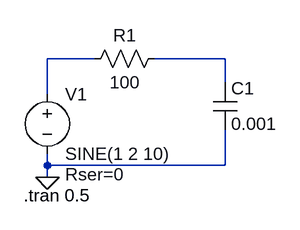
[diagram p0: schematic filtreRC.asc]
filtreRC.asc, the LTspice schematic file:
Version 4
SHEET 1 880 680
WIRE 48 48 -16 48
WIRE 224 48 128 48
WIRE 224 80 224 48
WIRE -16 96 -16 48
WIRE -16 192 -16 176
WIRE 224 192 224 144
WIRE 224 192 -16 192
WIRE -16 208 -16 192
FLAG -16 208 0
SYMBOL voltage -16 80 R0
WINDOW 123 0 0 Left 0
WINDOW 39 24 124 Left 2
SYMATTR SpiceLine Rser=0
SYMATTR InstName V1
SYMATTR Value SINE(1 2 10)
SYMBOL cap 208 80 R0
SYMATTR InstName C1
SYMATTR Value 0.001
SYMBOL res 144 32 R90
WINDOW 0 0 56 VBottom 2
WINDOW 3 32 56 VTop 2
SYMATTR InstName R1
SYMATTR Value 100
TEXT -48 232 Left 2 !.tran 0.5

The netlist it stands for:
* filtreRC.asc
V1 N001 0 SINE(1 2 10) Rser=0
C1 N002 0 0.001
R1 N002 N001 100
.tran 0.5
.backanno
.end